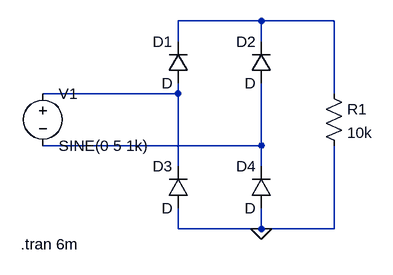
[diagram p0: schematic PontDiode.asc]
PontDiode.asc, the LTspice schematic file:
Version 4
SHEET 1 880 680
WIRE 256 48 128 48
WIRE 368 48 256 48
WIRE 128 80 128 48
WIRE 256 80 256 48
WIRE 128 160 128 144
WIRE 128 160 -80 160
WIRE 368 160 368 48
WIRE 256 240 256 144
WIRE 256 240 -80 240
WIRE 128 272 128 160
WIRE 256 272 256 240
WIRE 128 368 128 336
WIRE 256 368 256 336
WIRE 256 368 128 368
WIRE 368 368 368 240
WIRE 368 368 256 368
FLAG 256 368 0
SYMBOL diode 144 144 R180
WINDOW 0 24 64 Left 2
WINDOW 3 24 0 Left 2
SYMATTR InstName D1
SYMBOL diode 272 144 R180
WINDOW 0 24 64 Left 2
WINDOW 3 24 0 Left 2
SYMATTR InstName D2
SYMBOL diode 144 336 R180
WINDOW 0 24 64 Left 2
WINDOW 3 24 0 Left 2
SYMATTR InstName D3
SYMBOL diode 272 336 R180
WINDOW 0 24 64 Left 2
WINDOW 3 24 0 Left 2
SYMATTR InstName D4
SYMBOL res 352 144 R0
SYMATTR InstName R1
SYMATTR Value 10k
SYMBOL voltage -80 144 R0
WINDOW 123 0 0 Left 0
WINDOW 39 0 0 Left 0
SYMATTR InstName V1
SYMATTR Value SINE(0 5 1k)
TEXT -114 392 Left 2 !.tran 6m

The netlist it stands for:
* PontDiode.asc
D1 N002 N001 D
D2 N003 N001 D
D3 0 N002 D
D4 0 N003 D
R1 N001 0 10k
V1 N002 N003 SINE(0 5 1k)
.model D D
.lib standard.dio
.tran 6m
.backanno
.end